# Altium schematic sheet Stofzuiger.SchDoc
size A4; SheetNumber: 1; SheetTotal: 2
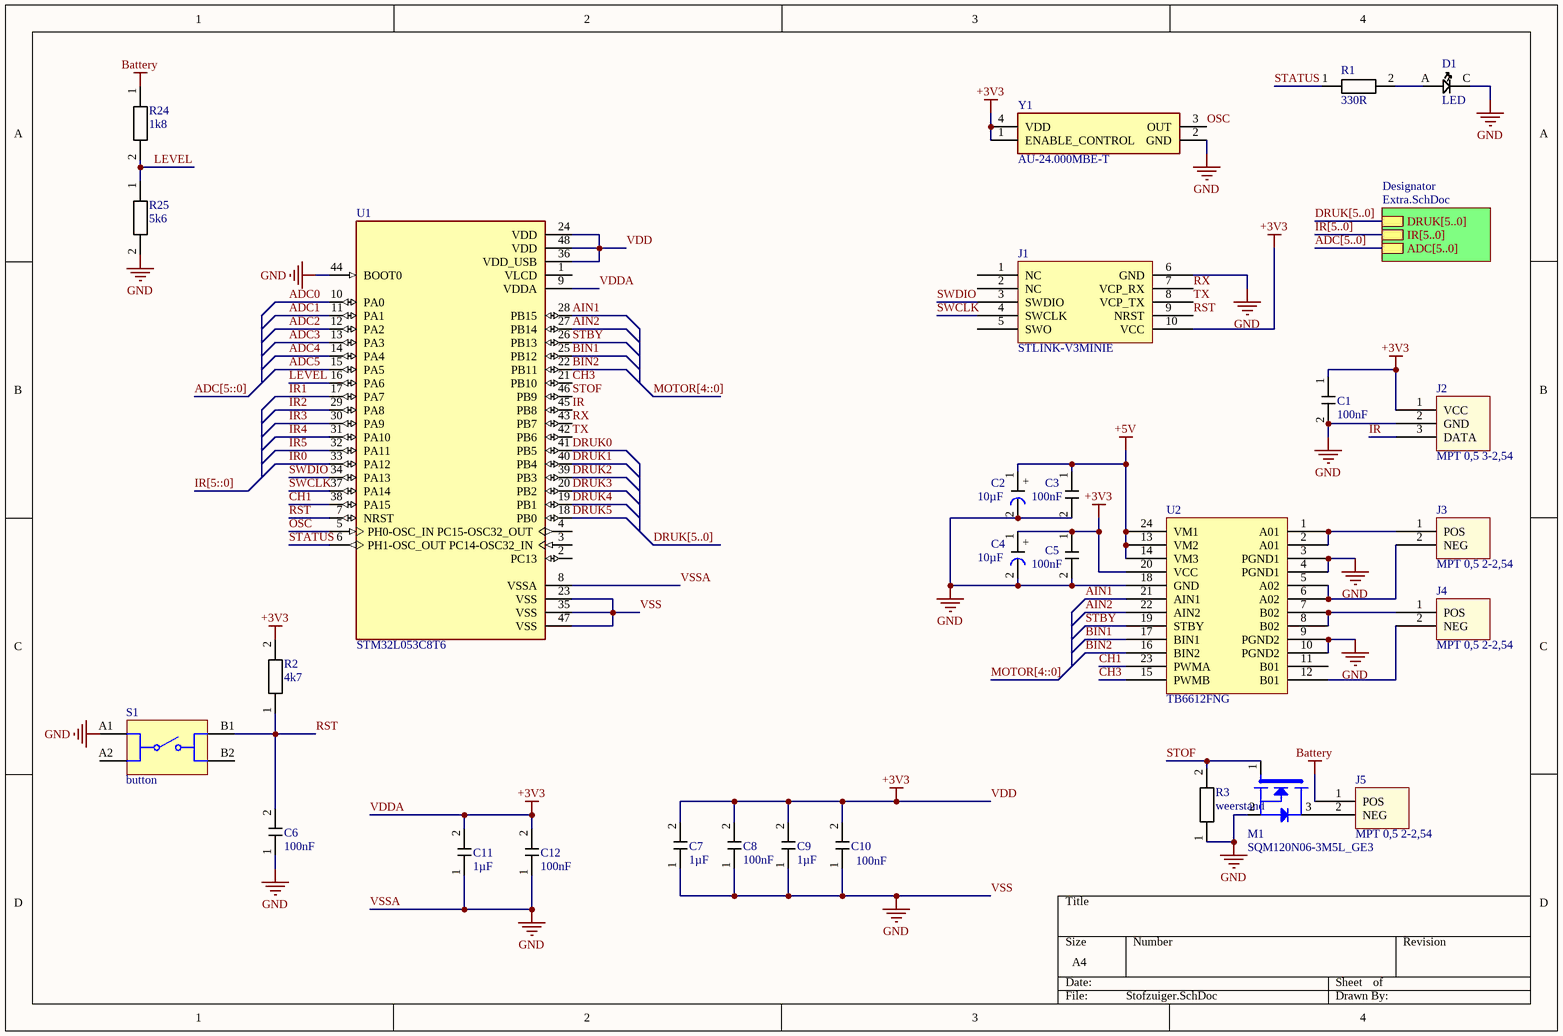
[diagram p0: Stofzuiger.SchDoc]

## Parts
C1  100nF  [0603]
C2  10µF  [0603]
C3  100nF  [0603]
C4  10µF  [0603]
C5  100nF  [0603]
C6  100nF  [0603]
C7  1µF  [0603]
C8  100nF  [0603]
C9  1µF  [0603]
C10  100nF  [0603]
C11  1µF  [0603]
C12  100nF  [0603]
D1  LED  [LED]
J1  STLINK-V3MINIE  [STLINK-V3MINIE]
J2  MPT 0,5 3-2,54  [MPT 0,5 3-2,54]
J3  MPT 0,5 2-2,54  [MPT 0,5 2-2,54]
J4  MPT 0,5 2-2,54  [MPT 0,5 2-2,54]
J5  MPT 0,5 2-2,54  [MPT 0,5 2-2,54]
M1  SQM120N06-3M5L_GE3  [IPB022N12NM6]
R1  330R  [0603]
R2  4k7  [0603]
R3  weerstand  [0603]
R24  1k8  [0603]
R25  5k6  [0603]
S1  button  [BUTTON]
U1  STM32L053C8T6  [stm32l053c8t6]
U2  TB6612FNG  [TB6612FNG]
Y1  AU-24.000MBE-T  [AU-24.000MBE-T]

## Sub-sheets
Designator = Extra.SchDoc: IR[5..0], ADC[5..0], DRUK[5..0]

## Nets
+5V: C2.1(+) C3.1(G) U2.13(VM2) U2.14(VM3) U2.24(VM1)
Battery: J5.1(POS) R24.1
VDD: C1.1(G) C4.1(+) C5.1(G) C7.2(G) C8.2(G) C9.2(G) C10.2(G) C11.2(G) C12.2(G) J1.10(VCC) J2.1(VCC) R2.2(G) U1.9(VDDA) U1.24(VDD) U1.36(VDD_USB) U1.48(VDD) U2.20(VCC) Y1.1(ENABLE_CONTROL) Y1.4(VDD)  [also labelled +3V3, VDDA]
VSS: C1.2(G) C2.2(G) C3.2(G) C4.2(G) C5.2(G) C6.1(G) C7.1(G) C8.1(G) C9.1(G) C10.1(G) C11.1(G) C12.1(G) D1.C J1.6(GND) J2.2(GND) M1.2(S) R3.1 R25.2(G) S1.A1 U1.8(VSSA) U1.23(VSS) U1.35(VSS) U1.44(BOOT0) U1.47(VSS) U2.3(PGND1) U2.4(PGND1) U2.9(PGND2) U2.10(PGND2) U2.18(GND) Y1.2(GND)  [also labelled GND, VSSA]
ADC0: U1.10(PA0)
ADC1: U1.11(PA1)
ADC2: U1.12(PA2)
ADC3: U1.13(PA3)
ADC4: U1.14(PA4)
ADC5: U1.15(PA5)
AIN1: U1.28(PB15) U2.21(AIN1)
AIN2: U1.27(PB14) U2.22(AIN2)
BIN1: U1.25(PB12) U2.17(BIN1)
BIN2: U1.22(PB11) U2.16(BIN2)
CH1: U1.38(PA15) U2.23(PWMA)
CH3: U1.21(PB10) U2.15(PWMB)
DRUK0: U1.41(PB5)
DRUK1: U1.40(PB4)
DRUK2: U1.39(PB3)
DRUK3: U1.20(PB2)
DRUK4: U1.19(PB1)
DRUK5: U1.18(PB0)
IR: J2.3(DATA) U1.45(PB8)
IR0: U1.33(PA12)
IR1: U1.17(PA7)
IR2: U1.29(PA8)
IR3: U1.30(PA9)
IR4: U1.31(PA10)
IR5: U1.32(PA11)
LEVEL: R24.2(G) R25.1 U1.16(PA6)
OSC: U1.5(PH0-OSC_IN) Y1.3(OUT)
RST: C6.2(G) J1.9(NRST) R2.1 S1.B1 U1.7(NRST)
RX: J1.7(VCP_RX) U1.43(PB7)
STATUS: R1.1 U1.6(PH1-OSC_OUT)
STBY: U1.26(PB13) U2.19(STBY)
STOF: M1.1(G) R3.2(G) U1.46(PB9)
SWCLK: J1.4(SWCLK) U1.37(PA14)
SWDIO: J1.3(SWDIO) U1.34(PA13)
TX: J1.8(VCP_TX) U1.42(PB6)
NetD1_A: D1.A R1.2(G)
NetJ3_1: J3.1(POS) U2.1(A01) U2.2(A01)
NetJ3_2: J3.2(NEG) U2.5(A02) U2.6(A02)
NetJ4_1: J4.1(POS) U2.7(B02) U2.8(B02)
NetJ4_2: J4.2(NEG) U2.12(B01)
NetJ5_2: J5.2(NEG) M1.3(D)

Not connected (* = marked no-connect by the designer): J1 1(NC) 2(NC) 5(SWO); S1 A2 B2; U1 1(VLCD) 2(PC13) 3(PC14-OSC32_IN) 4(PC15-OSC32_OUT); U2 11(B01)

## Buses and harness runs
bus ADC[5..0] = sheet Designator/ADC[5..0]
bus ADC[5::0]
bus DRUK[5..0]
bus DRUK[5..0] = sheet Designator/DRUK[5..0]
bus IR[5..0] = sheet Designator/IR[5..0]
bus IR[5::0]
bus MOTOR[4::0]

## Library data of the parts
C1 C3 C5 C11 C12 = cap
C2 C4 = elco
C6-C10 = Condensator
M1 = IPB022N12NM6
R1 R2 R24 R25 = weerstand